# EAGLE design MotorDriver (EAGLE 7.6.0)
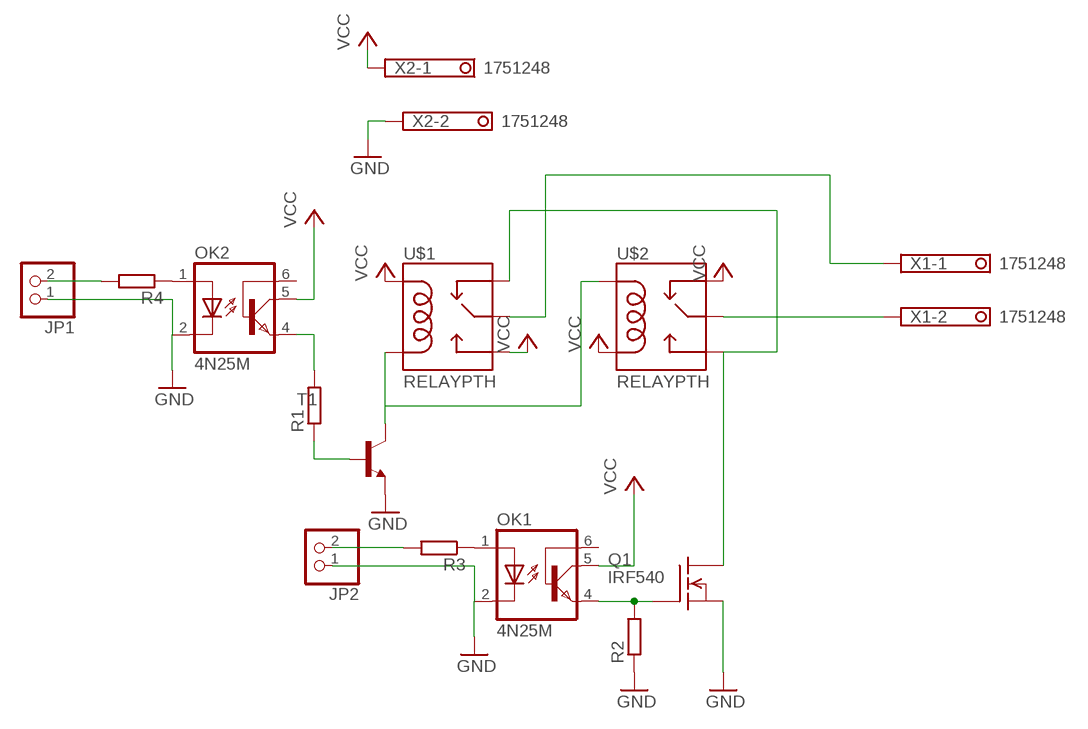
[diagram p0: schematic, sheet 1]

## Parts
JP1  PINHD-1X2  [1X02]
JP2  PINHD-1X2  [1X02]
OK1  4N25M  [DIL06]
OK2  4N25M  [DIL06]
Q1  IRF540  [TO220]
R1  R-EU_0204/7  [0204/7]
R2  R-EU_0204/7  [0204/7]
R3  R-EU_0204/7  [0204/7]
R4  R-EU_0204/7  [0204/7]
T1  2N2222-NPN-TO92-EBC  [TO92-EBC]
U$1  RELAYPTH  [SRD-05VDC-SL-C]
U$2  RELAYPTH  [SRD-05VDC-SL-C]
X1  1751248  [1751248]
X2  1751248  [1751248]

## Nets
GND: JP1.1 JP2.1 OK1.2(C) OK2.2(C) Q1.3(S) R2.1 T1.E X2.2
N$1: R1.1 T1.B
N$2: T1.C U$1.COIL0 U$2.COIL1
N$3: OK2.4(EMI) R1.2
N$4: Q1.2(D) U$1.SWCLOSED(SWCLOSE) U$2.SWOPEN
N$5: OK1.4(EMI) Q1.1(G) R2.2
N$6: OK1.1(A) R3.1
N$7: OK2.1(A) R4.1
N$8: JP1.2 R4.2
N$9: JP2.2 R3.2
N$10: U$2.SWCOMMON X1.2
N$11: U$1.SWCOMMON X1.1
VCC: OK1.5(COL) OK2.5(COL) U$1.COIL1 U$1.SWOPEN U$2.COIL0 U$2.SWCLOSED(SWCLOSE) X2.1
Unconnected: OK1.6(BAS) OK2.6(BAS)

## Library data of the parts
JP1 JP2 = pinhead:PINHD-1X2: PIN HEADER
OK1 OK2 = optocoupler:4N*?M: General Purpose 6-Pin Phototransistor Optocouplers Source: http://www.fairchildsemi.com/ds/4N/4N35-M.pdf; MPN: 4N25-M; OC_FARNELL: 1021349; OC_NEWARK: 98K9084
Q1 = transistor-fet:IRF540: N-Channel Enhancement MOSFET (HEXFET); 100V; 28A; 0,077Ohm
R1-R4 = resistor:R-EU_: RESISTOR, European symbol
T1 = transistor-neu-to92:*-NPN-: NPN Transistror
U$1 U$2 = SRD-05VDC-SL-C:RELAY: SPDT relay (COM-00101)
X1 X2 = con-phoenix-350:1751248: MKDS 1/ 2-3,5 Printklemme Nennstrom: 10 A Bemessungsspannung: 160 V Raster: 3,5 mm Polzahl: 2 Montageart: Löten Anschlussart: Schraubanschluss Anschlussrichtung vom Leiter zur Platine: 0° Source: http://eshop.phoenixcontact.com .. 1751248.pdf; OC_FARNELL: unknown; OC_NEWARK: unknown

## Board
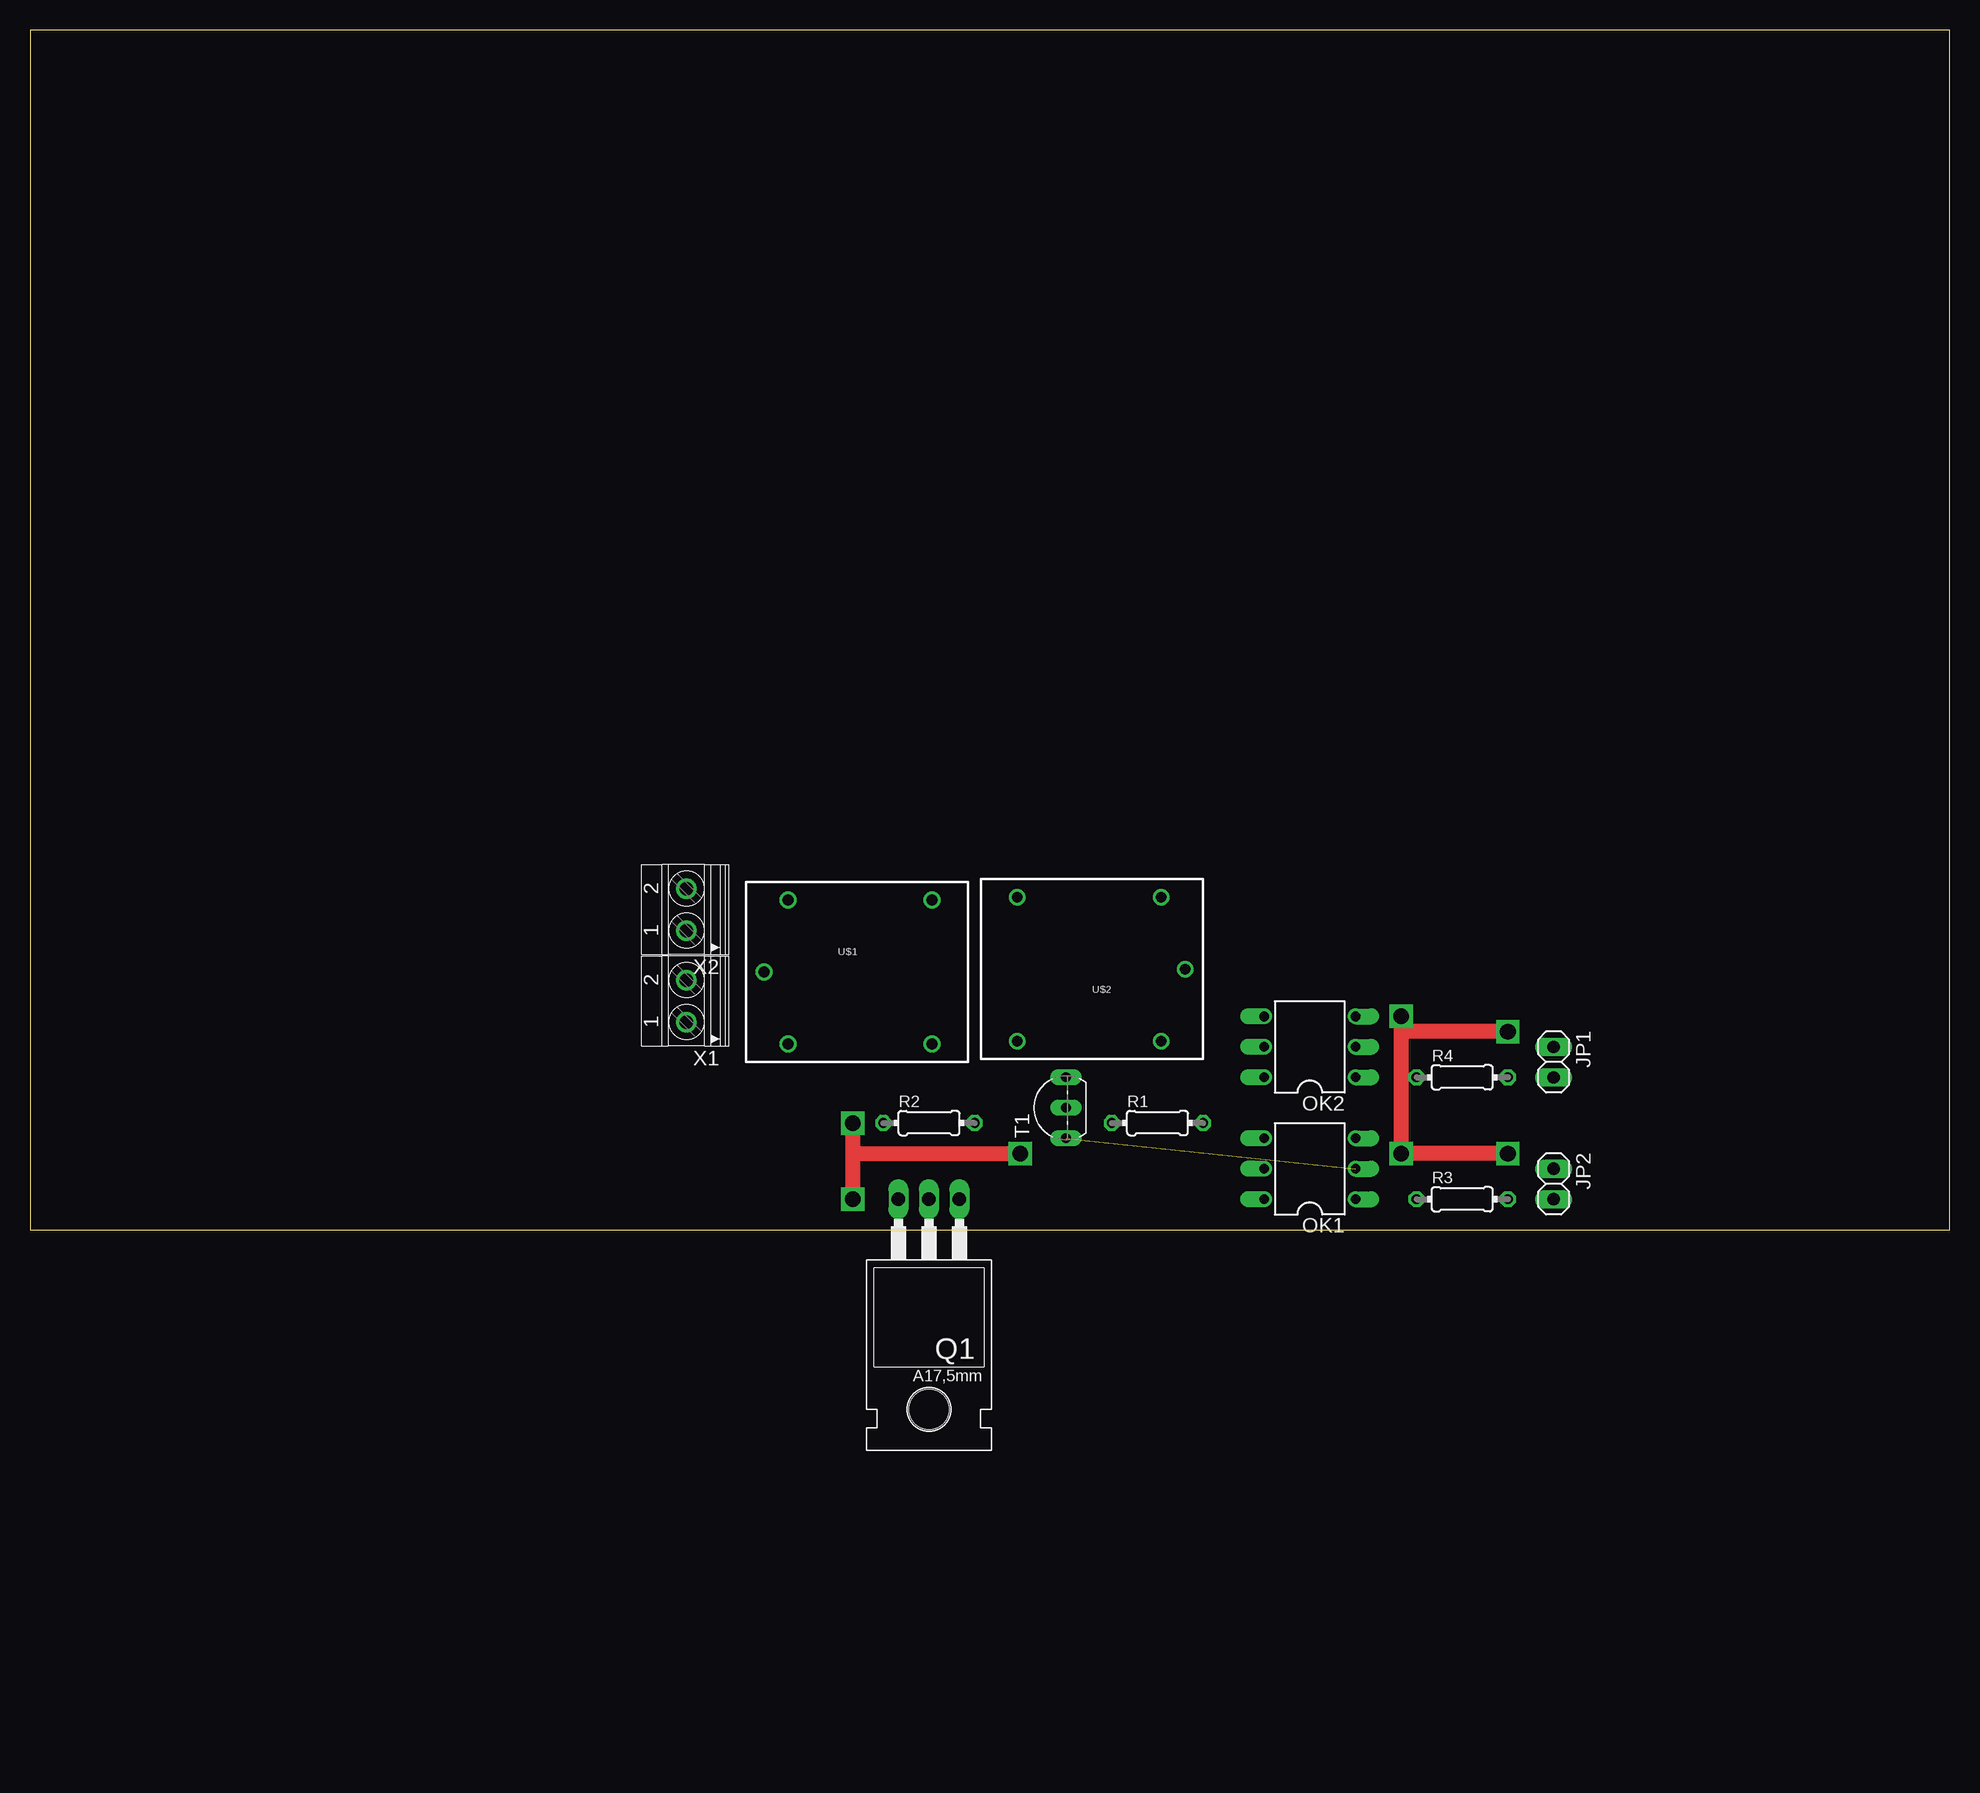
[diagram p1: board, top side]
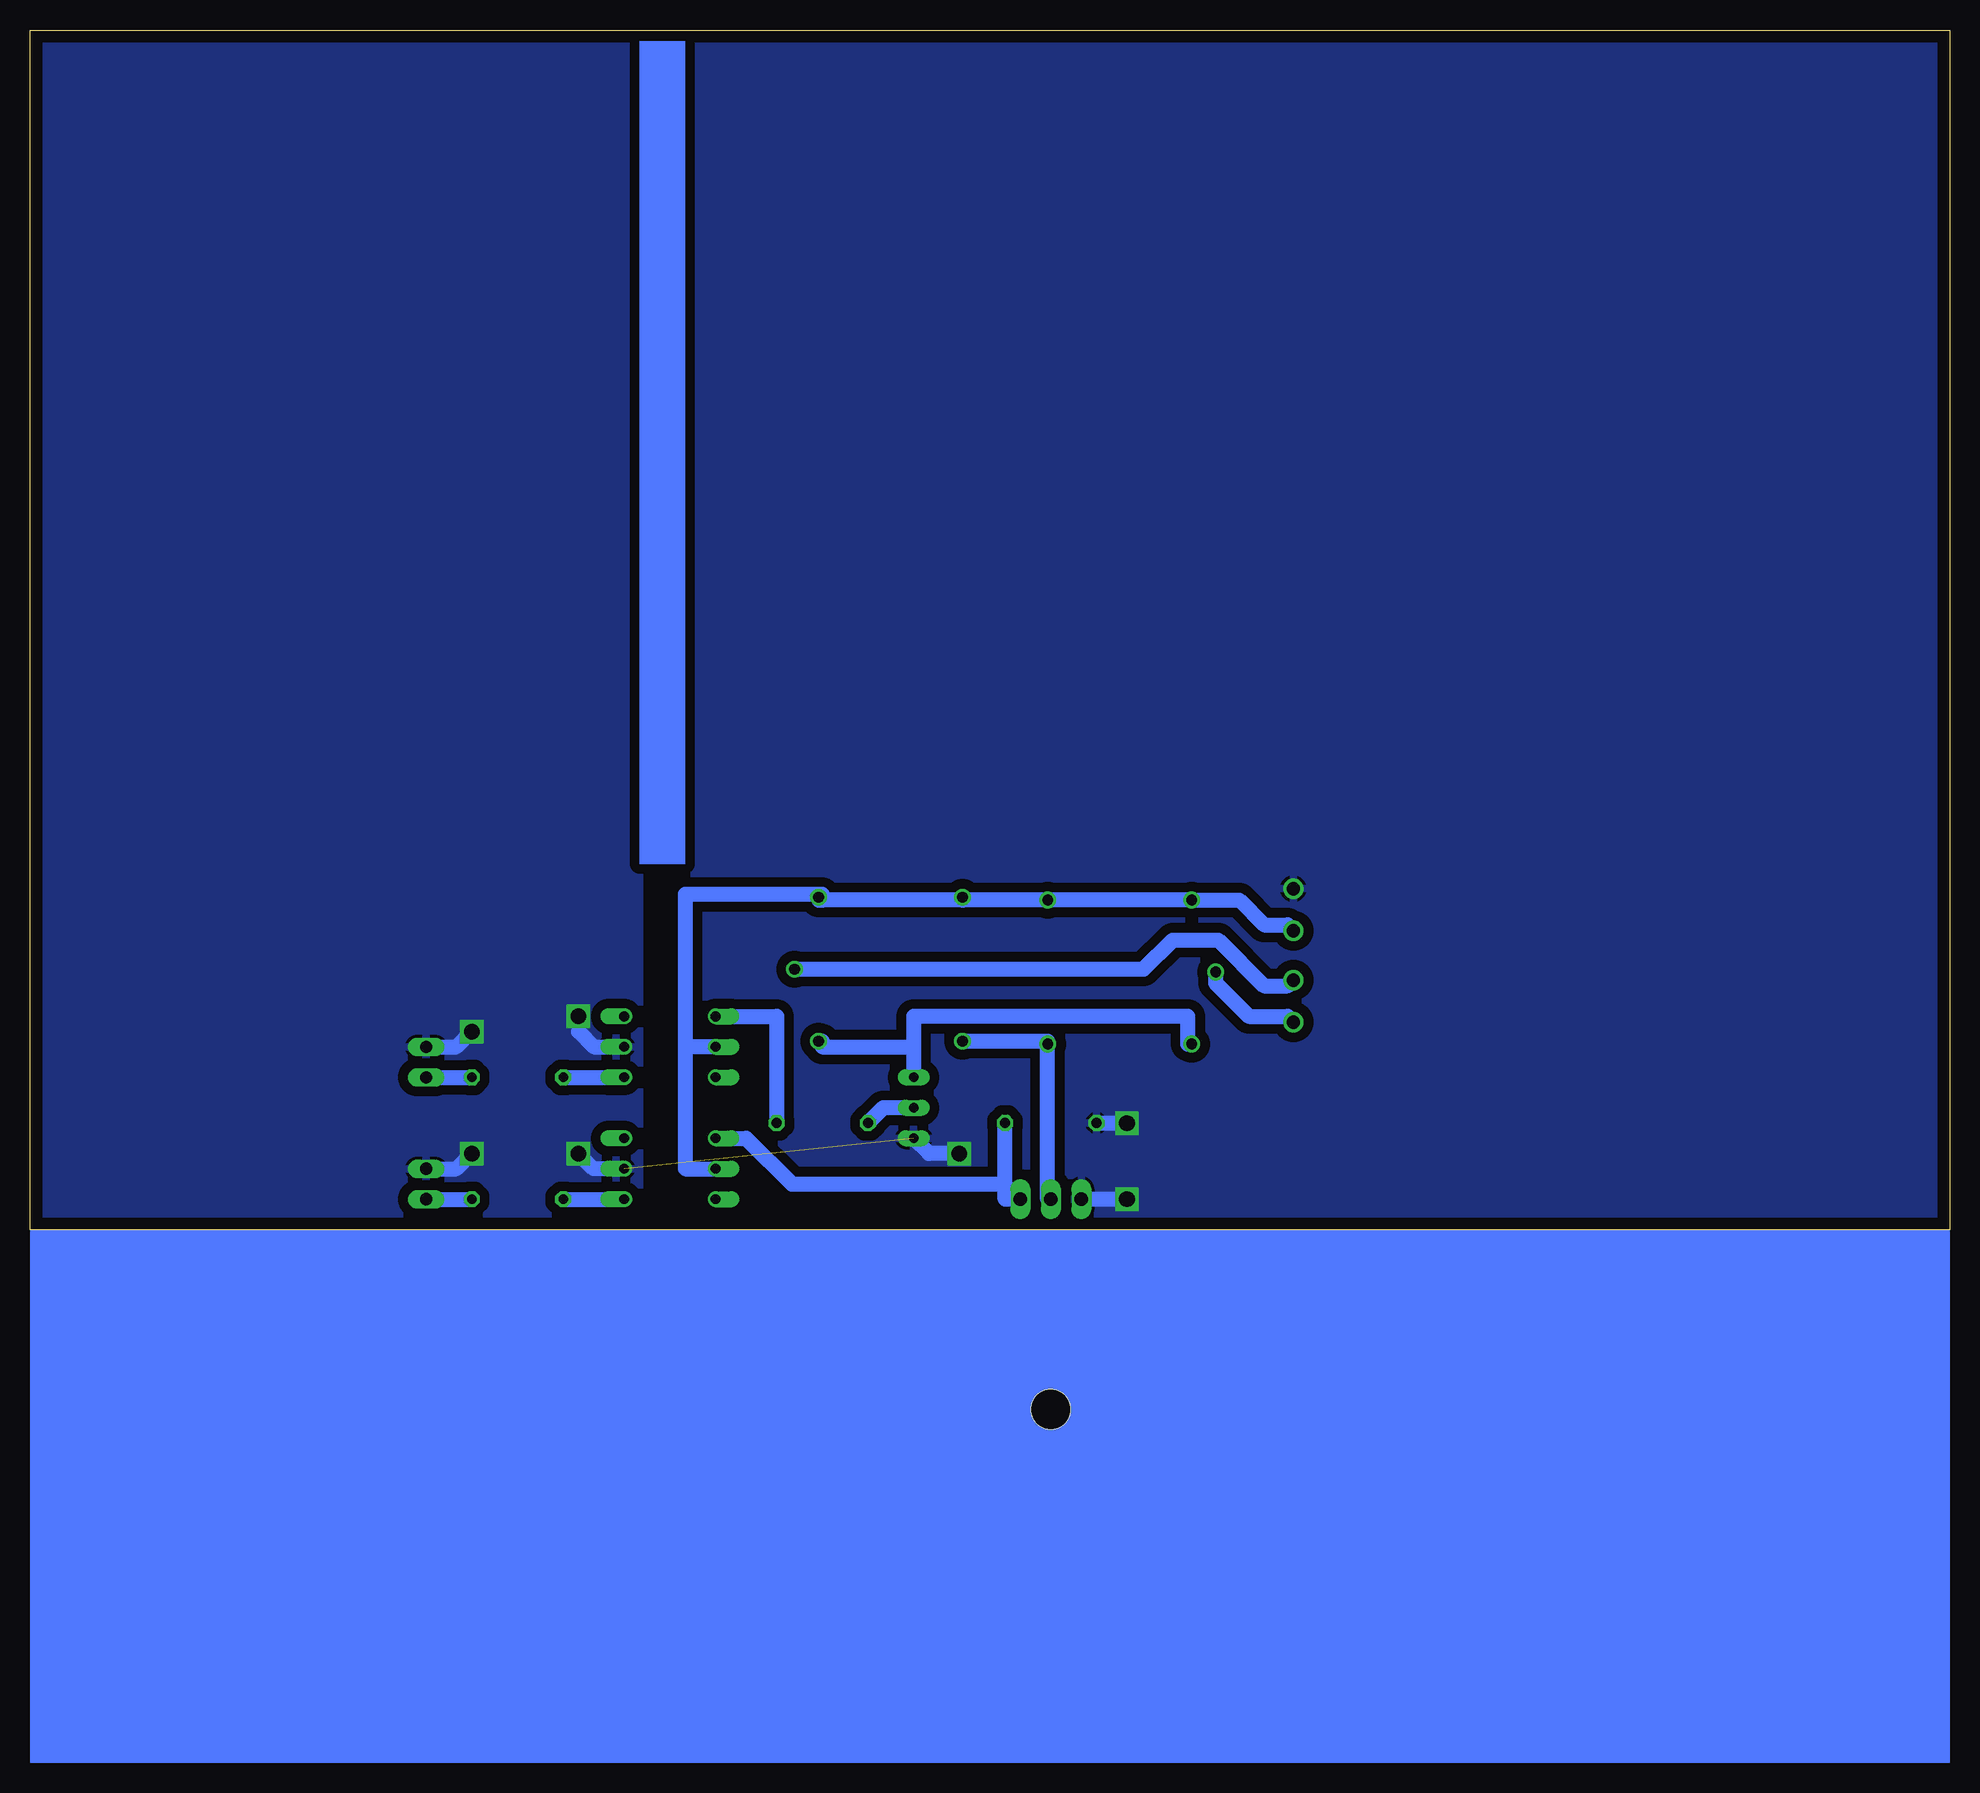
[diagram p2: board, bottom side, seen from below]

Size 160 x 100 mm. Coordinates in mm from the lower left corner, seen from the top.
Outline: 0,0 160,0 160,100 0,100 0,0
Copper layers (1*16): Top 0.035mm / dielectric 1.5mm / Bottom 0.035mm
Design rules "default": minimum track width 10mil, minimum drill 24mil, track to track 8mil, track to pad 8mil, pad to pad 8mil, via to via 8mil, smd to smd 8mil, copper to edge 40mil, drill to drill 8mil, minimum pad ring 10mil, minimum via ring 8mil, stop-mask expansion 4mil, vias tented up to drill 0mil, thermal gap 10mil

### Footprints (pad centres in the part's own frame; a part is rotated, then mirrored left to right if it is on the bottom)
1X02 = drill 1.016 long: 1 -1.27,0; 2 1.27,0
DIL06 = drill 0.813 offset: 1 -2.54,-3.81; 2 0,-3.81; 3 2.54,-3.81; 4 2.54,3.81; 5 0,3.81; 6 -2.54,3.81
TO220 = drill 1.118 long: 1 -2.54,-6.35; 2 0,-6.35; 3 2.54,-6.35 | hole 3.302: 0,11.176
0204/7 = drill 0.813 octagon: 1 -3.81,0; 2 3.81,0
TO92-EBC = drill 0.813 long: B 0,-1.27; C 2.54,-1.27; E -2.54,-1.27
SRD-05VDC-SL-C = drill 0.9: COIL0 -5.39,-6.12; COIL1 -5.39,5.88; SWCLOSED 6.61,-6.12; SWCOMMON -7.39,-0.12; SWOPEN 6.61,5.88
1751248 = drill 1.1 pad 1.7: 1 -1.75,-0.1; 2 1.75,-0.1

### Placement (x,y rotation side)
JP1  127,13.97 270 top
JP2  127,3.81 270 top
OK1  106.68,5.08 90 top
OK2  106.68,15.24 90 top
Q1  74.93,-3.81 180 top
R1  93.98,8.89 0 top
R2  74.93,8.89 0 top
R3  119.38,2.54 0 top
R4  119.38,12.7 0 top
T1  85.09,10.16 90 top
U$1  68.58,21.59 0 top
U$2  88.9,21.59 180 top
X1  54.61,19.05 90 top
X2  54.61,26.67 90 top

### Tracks (layer width: path | path; a pad name or v marks a point on that pad's centre or on a via)
GND  (via drill 1.3)  (1 unrouted)
  Top 1.27: 68.58,6.35 v68.58,2.54 | v68.58,8.89 68.58,6.35 | 68.58,6.35 v82.55,6.35 | 114.3,16.51 v114.3,6.35 v123.19,6.35 | 114.3,16.51 v114.3,17.78 | v123.19,16.51 114.3,16.51
  Bottom 1.27: R2.1 v68.58,8.89 | v68.58,2.54 Q1.3 | v82.55,6.35 85.09,6.35 T1.E | OK1.2 113.03,5.08 v114.3,6.35 | v114.3,17.78 114.3,16.51 113.03,15.24 OK2.2 | JP2.1 124.46,5.08 v123.19,6.35 | JP1.1 124.46,15.24 v123.19,16.51
  pour Bottom (isolate 0.813): 105.41,0 105.41,100.33 0,100.33 0,0
  pour Bottom (isolate 0.813): 109.22,0 160.02,0 160.02,100.33 109.22,100.33
N$1
  Bottom 1.27: T1.B 88.9,10.16 R1.1
N$2
  Bottom 1.27: U$2.COIL1 93.98,15.71 93.98,15.24 86.36,15.24 | 86.36,15.24 T1.C | U$1.COIL0 63.5,15.47 63.5,17.78 86.36,17.78 86.36,15.24
N$3
  Bottom 1.27: OK2.4 97.79,17.78 R1.2
N$4
  Bottom 1.27: U$2.SWOPEN 75.19,15.71 U$1.SWCLOSED 75.19,2.54 Q1.2
N$5
  Bottom 1.27: Q1.1 78.74,2.54 78.74,3.81 | 78.74,3.81 R2.2 | OK1.4 100.33,7.62 96.52,3.81 78.74,3.81
N$6
  Bottom 1.27: R3.1 OK1.1
N$7
  Bottom 1.27: R4.1 OK2.1
N$8
  Bottom 1.27: JP1.2 R4.2
N$9
  Bottom 1.27: JP2.2 R3.2
N$10
  Bottom 1.27: U$2.SWCOMMON 67.19,21.71 64.77,24.13 60.96,24.13 57.15,20.32 55.19,20.32 X1.2
N$11
  Bottom 1.27: U$1.SWCOMMON 61.19,20.55 58.42,17.78 55.19,17.78 X1.1
VCC
  Bottom 1.27: OK2.5 105.41,15.24 | 105.41,15.24 105.41,5.08 OK1.5 | 82.29,27.47 U$1.SWOPEN U$1.COIL1 59.22,27.47 57.15,25.4 55.19,25.4 X2.1 | 82.29,27.47 U$2.SWCLOSED | 82.29,27.47 93.98,27.47 | U$2.COIL0 94.29,27.47 93.98,27.47 | 93.98,27.47 93.98,27.94 105.41,27.94 105.41,15.24
(copper drawn outside any net)
  shapes: Bottom area x2